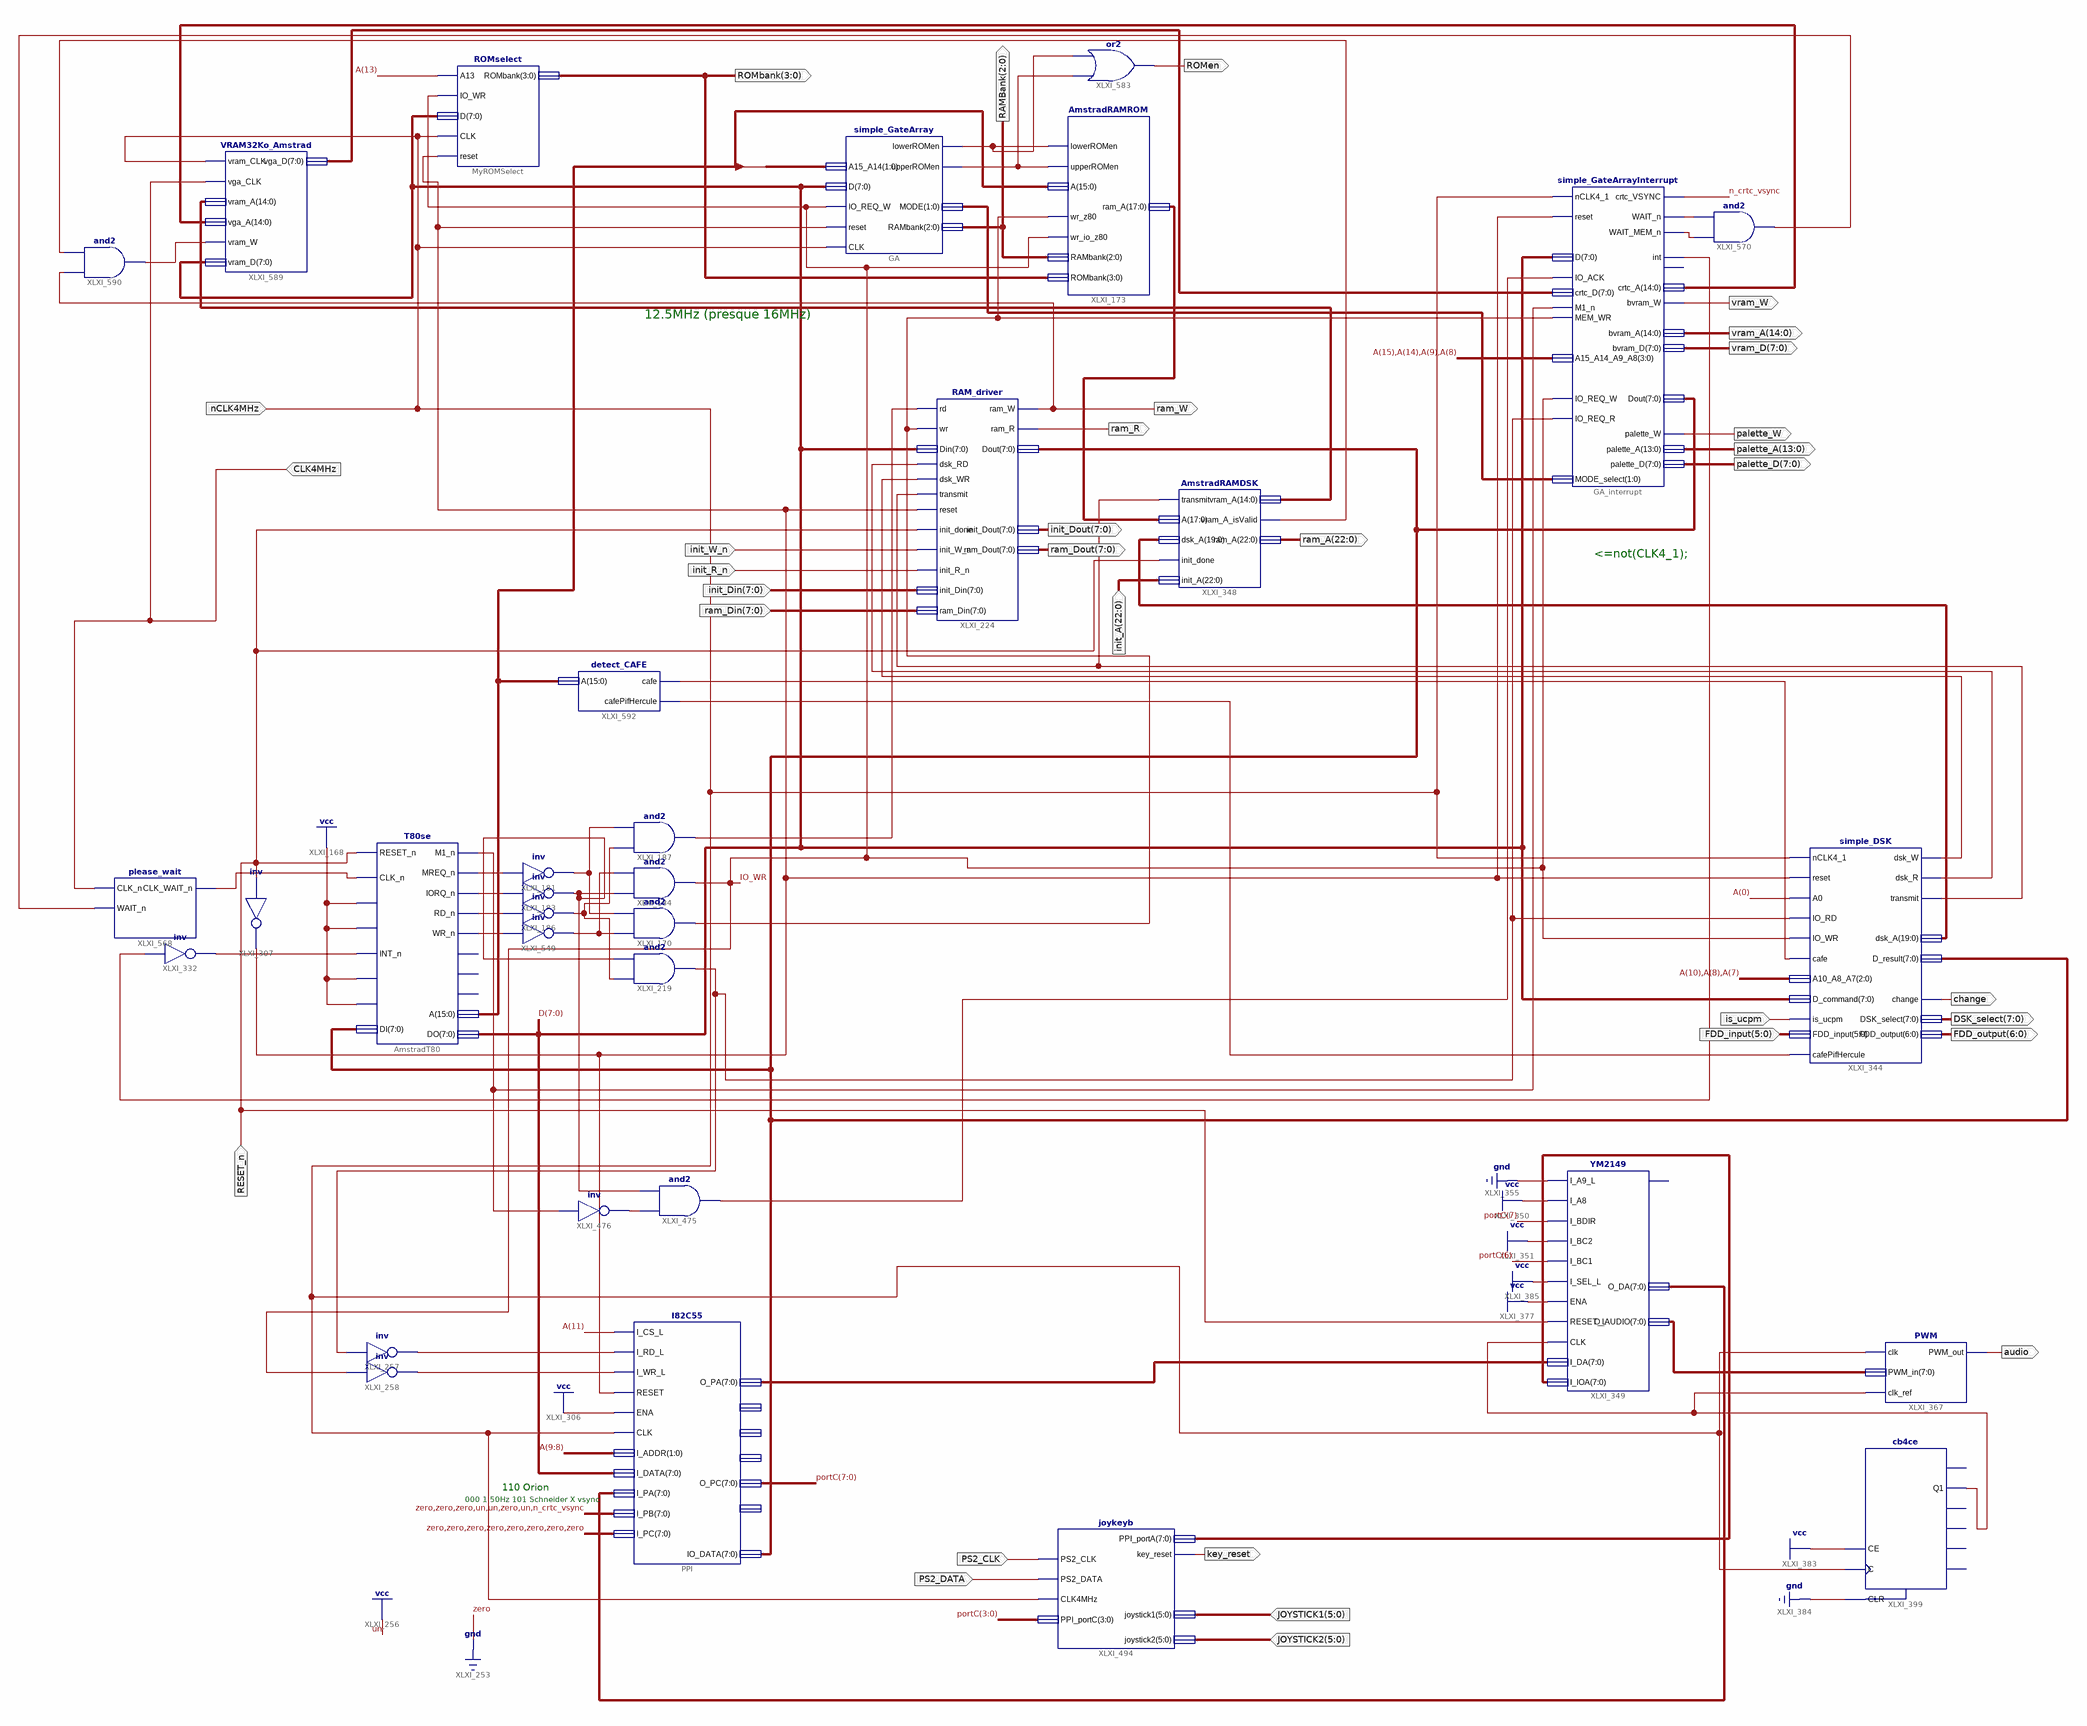
[diagram p0: schematic sheet 1]
// Xilinx ISE schematic amstrad_motherboard.sch (artix7) as structural Verilog: 33 symbols, 33 ports
module amstrad_motherboard (
  input  [22:0] init_A,
  input  CLK4MHz,
  input  nCLK4MHz,
  input  is_ucpm,
  input  RESET_n,
  input  PS2_DATA,
  input  PS2_CLK,
  input  [5:0] FDD_input,
  input  init_R_n,
  input  init_W_n,
  input  [7:0] init_Din,
  input  [7:0] ram_Din,
  input  [5:0] JOYSTICK1,
  input  [5:0] JOYSTICK2,
  output [2:0] RAMBank,
  output [3:0] ROMbank,
  output [22:0] ram_A,
  output audio,
  output [7:0] vram_D,
  output [13:0] palette_A,
  output [7:0] palette_D,
  output vram_W,
  output [14:0] vram_A,
  output ROMen,
  output ram_W,
  output palette_W,
  output ram_R,
  output key_reset,
  output change,
  output [7:0] DSK_select,
  output [6:0] FDD_output,
  output [7:0] init_Dout,
  output [7:0] ram_Dout
);

  wire IO_RD, IO_REQ, IO_WR, LED1, LED2, MEM_RD, MEM_WR, n_crtc_vsync, XLXN_38, XLXN_58, XLXN_75, XLXN_86,
       XLXN_180, XLXN_785, XLXN_786, XLXN_787, XLXN_802, XLXN_806, XLXN_807, XLXN_814, XLXN_824, XLXN_826,
       XLXN_830, XLXN_835, XLXN_845, XLXN_872, XLXN_884, XLXN_904, XLXN_907, XLXN_908, XLXN_914, XLXN_915,
       XLXN_916, XLXN_918, XLXN_940;
  wire [1:0] XLXN_857;
  wire [7:0] D, portC, XLXN_283, XLXN_462, XLXN_486, XLXN_518, XLXN_519, XLXN_869;
  wire [14:0] XLXN_868, XLXN_874;
  wire [15:0] A;
  wire [17:0] xram_A;
  wire [19:0] XLXN_427;

  simple_GateArray #(.KEEP_HIERARCHY("TRUE")) GA (
    .CLK(nCLK4MHz), .reset(XLXN_907), .IO_REQ_W(IO_WR), .A15_A14(A[15:14]), .D(D), .lowerROMen(LED1),
    .upperROMen(LED2), .MODE(XLXN_857), .RAMbank(RAMBank));
  AmstradRAMROM XLXI_173 (
    .wr_z80(MEM_WR), .wr_io_z80(IO_WR), .lowerROMen(LED1), .upperROMen(LED2), .A(A), .RAMbank(RAMBank),
    .ROMbank(ROMbank), .ram_A(xram_A));
  AmstradRAMDSK XLXI_348 (
    .transmit(XLXN_908), .init_done(RESET_n), .A(xram_A), .dsk_A(XLXN_427), .init_A(init_A),
    .vram_A_isValid(XLXN_872), .ram_A(ram_A), .vram_A(XLXN_874));
  ROMselect #(.KEEP_HIERARCHY("TRUE")) MyROMSelect (
    .CLK(nCLK4MHz), .reset(XLXN_907), .A13(A[13]), .IO_WR(IO_WR), .D(D), .ROMbank(ROMbank));
  T80se AmstradT80 (
    .RESET_n(RESET_n), .CLK_n(XLXN_802), .CLKEN(1'b1), .WAIT_n(1'b1), .INT_n(XLXN_814), .NMI_n(1'b1),
    .BUSRQ_n(1'b1), .DI(XLXN_283), .M1_n(XLXN_845), .MREQ_n(XLXN_58), .IORQ_n(XLXN_75), .RD_n(XLXN_86),
    .WR_n(XLXN_38), .A(A), .DO(D));  // open: RFSH_n, HALT_n, BUSAK_n
  not XLXI_183 (IO_REQ, XLXN_75);
  and XLXI_184 (IO_WR, IO_REQ, XLXN_785);
  and XLXI_170 (MEM_WR, XLXN_785, XLXN_786);
  not XLXI_186 (XLXN_787, XLXN_86);
  and XLXI_187 (MEM_RD, XLXN_787, XLXN_786);
  and XLXI_219 (IO_RD, XLXN_787, IO_REQ);
  not XLXI_257 (XLXN_180, IO_RD);
  I82C55 PPI (
    .I_CS_L(A[11]), .I_RD_L(XLXN_180), .I_WR_L(XLXN_904), .RESET(XLXN_907), .ENA(1'b1), .CLK(nCLK4MHz),
    .I_ADDR(A[9:8]), .I_DATA(D), .I_PA(XLXN_519), .I_PB({7'b0001101, n_crtc_vsync}), .I_PC({8{1'b0}}),
    .IO_DATA(XLXN_283), .O_PA(XLXN_462), .O_PC(portC));  // open: O_PA_OE_L, O_PB, O_PB_OE_L, O_PC_OE_L
  simple_DSK XLXI_344 (
    .nCLK4_1(nCLK4MHz), .reset(XLXN_907), .A0(A[0]), .IO_RD(IO_RD), .IO_WR(IO_WR), .cafe(XLXN_916),
    .cafePifHercule(XLXN_918), .is_ucpm(is_ucpm), .A10_A8_A7({A[10], A[8:7]}), .D_command(D),
    .FDD_input(FDD_input), .D_result(XLXN_283), .change(change), .dsk_W(XLXN_914), .dsk_R(XLXN_915),
    .transmit(XLXN_908), .DSK_select(DSK_select), .dsk_A(XLXN_427), .FDD_output(FDD_output));
  not XLXI_332 (XLXN_814, XLXN_835);
  YM2149 XLXI_349 (
    .I_A9_L(1'b0), .I_A8(1'b1), .I_BDIR(portC[7]), .I_BC2(1'b1), .I_BC1(portC[6]), .I_SEL_L(1'b1),
    .ENA(1'b1), .RESET_L(RESET_n), .CLK(XLXN_940), .I_DA(XLXN_462), .I_IOA(XLXN_518), .O_DA(XLXN_519),
    .O_AUDIO(XLXN_486));  // open: O_DA_OE_L
  PWM XLXI_367 (.clk(nCLK4MHz), .clk_ref(XLXN_940), .PWM_in(XLXN_486), .PWM_out(audio));
  cb4ce XLXI_399 (.C(nCLK4MHz), .CE(1'b1), .CLR(1'b0), .Q1(XLXN_940));  // open: CEO, Q0, Q2, Q3, TC
  not XLXI_181 (XLXN_786, XLXN_58);
  not XLXI_549 (XLXN_785, XLXN_38);
  not XLXI_476 (XLXN_824, XLXN_845);
  not XLXI_307 (XLXN_907, RESET_n);
  joykeyb XLXI_494 (
    .CLK4MHz(nCLK4MHz), .PPI_portC(portC[3:0]), .joystick1(JOYSTICK1), .joystick2(JOYSTICK2),
    .PS2_DATA(PS2_DATA), .PS2_CLK(PS2_CLK), .PPI_portA(XLXN_518), .key_reset(key_reset));
  and XLXI_475 (XLXN_826, XLXN_824, IO_REQ);
  please_wait XLXI_568 (.CLK_n(CLK4MHz), .WAIT_n(XLXN_830), .CLK_WAIT_n(XLXN_802));
  simple_GateArrayInterrupt #(.KEEP_HIERARCHY("TRUE")) GA_interrupt (
    .IO_REQ_W(IO_WR), .IO_REQ_R(IO_RD), .IO_ACK(XLXN_826), .M1_n(XLXN_845), .MEM_WR(MEM_WR),
    .reset(XLXN_907), .A15_A14_A9_A8({A[15:14], A[9:8]}), .MODE_select(XLXN_857), .D(D), .crtc_D(XLXN_869),
    .Dout(XLXN_283), .crtc_VSYNC(n_crtc_vsync), .bvram_W(vram_W), .\int (XLXN_835), .WAIT_MEM_n(XLXN_807),
    .WAIT_n(XLXN_806), .palette_W(palette_W), .crtc_A(XLXN_868), .bvram_A(vram_A), .bvram_D(vram_D),
    .palette_A(palette_A), .palette_D(palette_D), .nCLK4_1(nCLK4MHz));  // open: crtc_R
  and XLXI_570 (XLXN_830, XLXN_807, XLXN_806);
  or XLXI_583 (ROMen, LED2, LED1);
  VRAM32Ko_Amstrad XLXI_589 (
    .vram_CLK(nCLK4MHz), .vga_CLK(CLK4MHz), .vram_A(XLXN_874), .vga_A(XLXN_868), .vram_W(XLXN_884),
    .vram_D(D), .vga_D(XLXN_869));
  and XLXI_590 (XLXN_884, ram_W, XLXN_872);
  not XLXI_258 (XLXN_904, IO_WR);
  detect_CAFE XLXI_592 (.A(A), .cafe(XLXN_916), .cafePifHercule(XLXN_918));
  RAM_driver XLXI_224 (
    .rd(MEM_RD), .wr(MEM_WR), .dsk_RD(XLXN_915), .dsk_WR(XLXN_914), .transmit(XLXN_908), .reset(XLXN_907),
    .Din(D), .Dout(XLXN_283), .ram_W(ram_W), .ram_R(ram_R), .init_done(RESET_n), .init_W_n(init_W_n),
    .init_R_n(init_R_n), .init_Din(init_Din), .ram_Din(ram_Din), .init_Dout(init_Dout), .ram_Dout(ram_Dout));

  // Notes on the sheet:
  //   12.5MHz (presque 16MHz)
  //   <=not(CLK4_1);
  //   110 Orion
  //   000 1 50Hz 101 Schneider X vsync
endmodule
